# EAGLE schematic mcu (EAGLE 8.1.0)
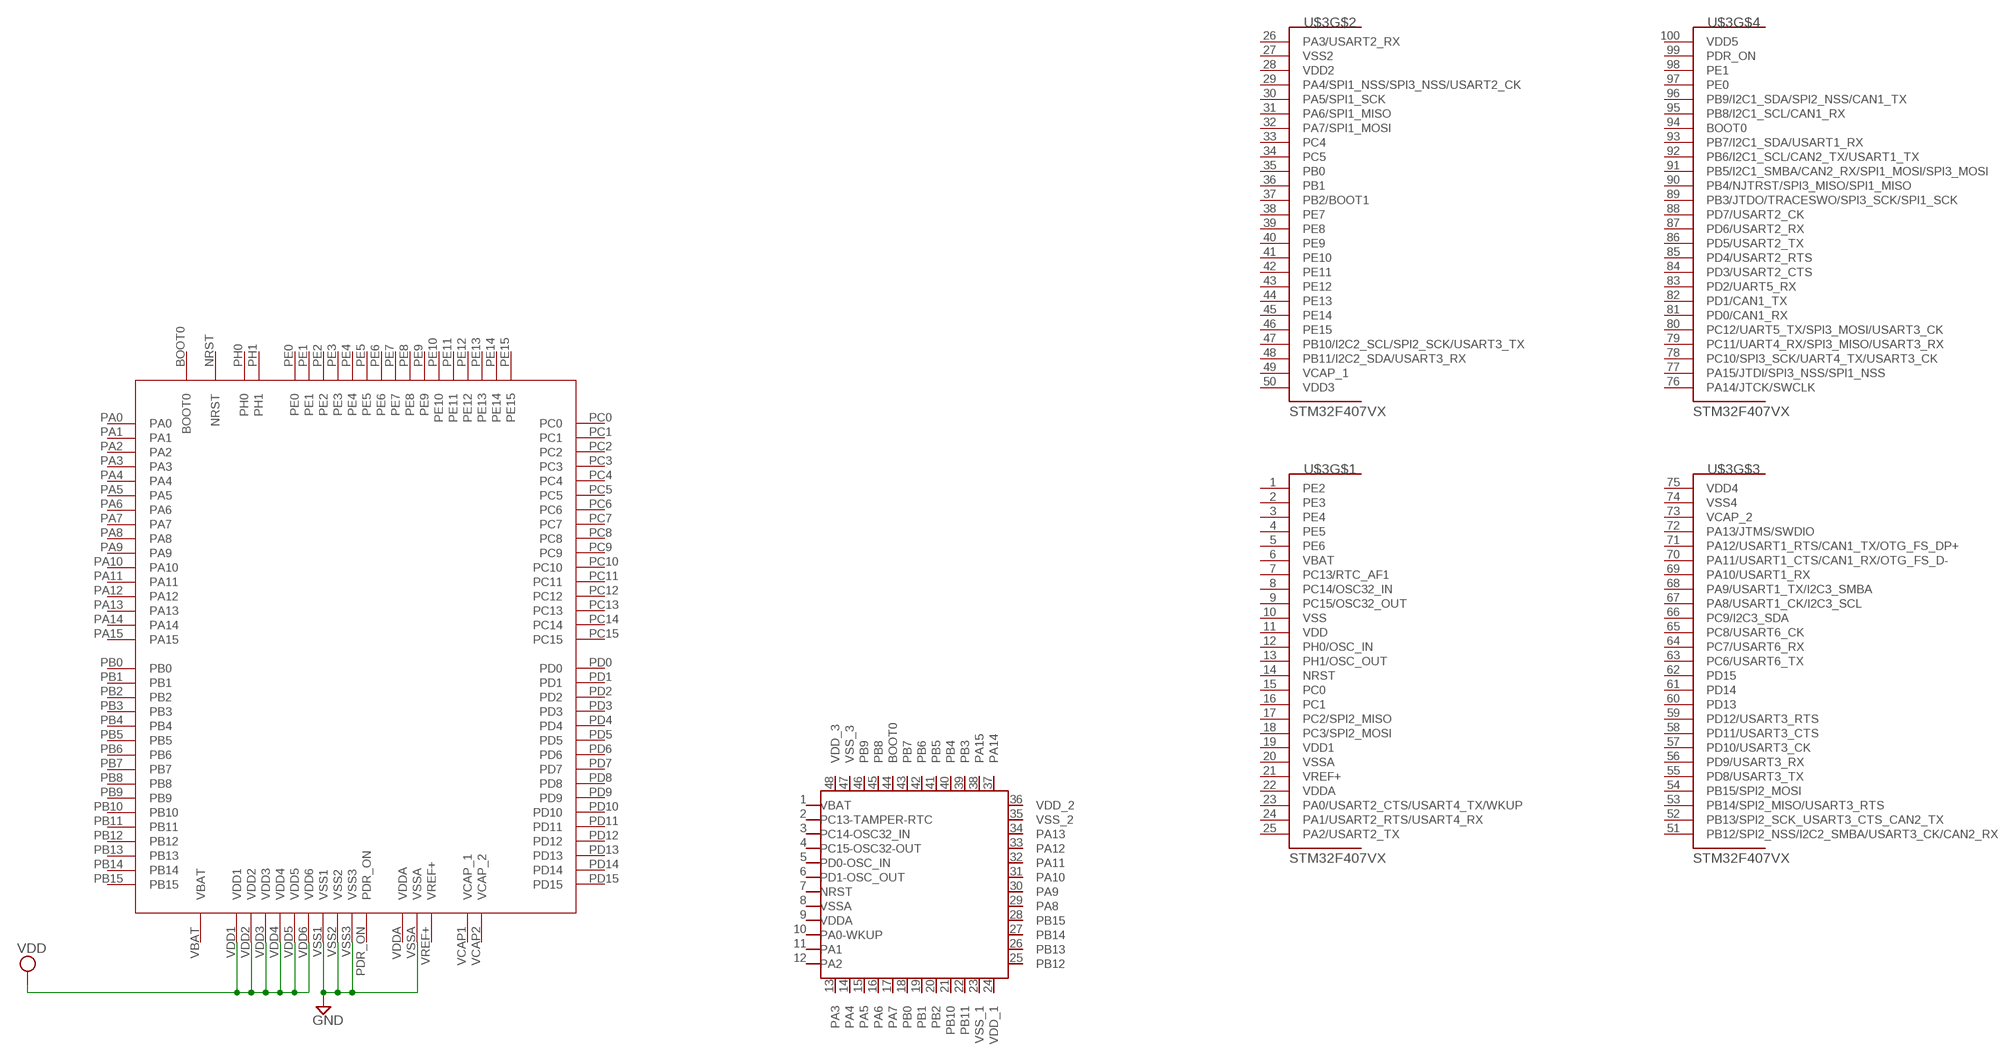
[diagram p0: schematic, sheet 1]

## Parts
U$1  STM32F4V_100PIN_GENERIC  [LQFP100]
U$2  STM32F103_TQFP48_7X7  [LQFP48_7X7]
U$3  STM32F407VX  [LQFP100]

## Nets
GND: U$1.VSS1 U$1.VSS2 U$1.VSS3 U$1.VSSA
VDD: U$1.VDD1 U$1.VDD2 U$1.VDD3 U$1.VDD4 U$1.VDD5 U$1.VDD6
Unconnected: U$1.BOOT0 U$1.NRST U$1.PA0 U$1.PA1 U$1.PA2 U$1.PA3 U$1.PA4 U$1.PA5 U$1.PA6 U$1.PA7 U$1.PA8 U$1.PA9 U$1.PA10 U$1.PA11 U$1.PA12 U$1.PA13 U$1.PA14 U$1.PA15 U$1.PB0 U$1.PB1 U$1.PB2 U$1.PB3 U$1.PB4 U$1.PB5 U$1.PB6 U$1.PB7 U$1.PB8 U$1.PB9 U$1.PB10 U$1.PB11 U$1.PB12 U$1.PB13 U$1.PB14 U$1.PB15 U$1.PC0 U$1.PC1 U$1.PC2 U$1.PC3 U$1.PC4 U$1.PC5 U$1.PC6 U$1.PC7 U$1.PC8 U$1.PC9 U$1.PC10 U$1.PC11 U$1.PC12 U$1.PC13 U$1.PC14 U$1.PC15 U$1.PD0 U$1.PD1 U$1.PD2 U$1.PD3 U$1.PD4 U$1.PD5 U$1.PD6 U$1.PD7 U$1.PD8 U$1.PD9 U$1.PD10 U$1.PD11 U$1.PD12 U$1.PD13 U$1.PD14 U$1.PD15 U$1.PDR_ON U$1.PE0 U$1.PE1 U$1.PE2 U$1.PE3 U$1.PE4 U$1.PE5 U$1.PE6 U$1.PE7 U$1.PE8 U$1.PE9 U$1.PE10 U$1.PE11 U$1.PE12 U$1.PE13 U$1.PE14 U$1.PE15 U$1.PH0 U$1.PH1 U$1.VBAT U$1.VCAP1(VCAP_1) U$1.VCAP2(VCAP_2) U$1.VDDA U$1.VREF+ U$2.1(VBAT) U$2.2(PC13-TAMPER-RTC) U$2.3(PC14-OSC32_IN) U$2.4(PC15-OSC32-OUT) U$2.5(PD0-OSC_IN) U$2.6(PD1-OSC_OUT) U$2.7(NRST) U$2.8(VSSA) U$2.9(VDDA) U$2.10(PA0-WKUP) U$2.11(PA1) U$2.12(PA2) U$2.13(PA3) U$2.14(PA4) U$2.15(PA5) U$2.16(PA6) U$2.17(PA7) U$2.18(PB0) U$2.19(PB1) U$2.20(PB2) U$2.21(PB10) U$2.22(PB11) U$2.23(VSS_1) U$2.24(VDD_1) U$2.25(PB12) U$2.26(PB13) U$2.27(PB14) U$2.28(PB15) U$2.29(PA8) U$2.30(PA9) U$2.31(PA10) U$2.32(PA11) U$2.33(PA12) U$2.34(PA13) U$2.35(VSS_2) U$2.36(VDD_2) U$2.37(PA14) U$2.38(PA15) U$2.39(PB3) U$2.40(PB4) U$2.41(PB5) U$2.42(PB6) U$2.43(PB7) U$2.44(BOOT0) U$2.45(PB8) U$2.46(PB9) U$2.47(VSS_3) U$2.48(VDD_3) U$3.1(PE2) U$3.2(PE3) U$3.3(PE4) U$3.4(PE5) U$3.5(PE6) U$3.6(VBAT) U$3.7(PC13/RTC_AF1) U$3.8(PC14/OSC32_IN) U$3.9(PC15/OSC32_OUT) U$3.10(VSS) U$3.11(VDD) U$3.12(PH0/OSC_IN) U$3.13(PH1/OSC_OUT) U$3.14(NRST) U$3.15(PC0) U$3.16(PC1) U$3.17(PC2/SPI2_MISO) U$3.18(PC3/SPI2_MOSI) U$3.19(VDD1) U$3.20(VSSA) U$3.21(VREF+) U$3.22(VDDA) U$3.23(PA0/USART2_CTS/USART4_TX/WKUP) U$3.24(PA1/USART2_RTS/USART4_RX) U$3.25(PA2/USART2_TX) U$3.26(PA3/USART2_RX) U$3.27(VSS2) U$3.28(VDD2) U$3.29(PA4/SPI1_NSS/SPI3_NSS/USART2_CK) U$3.30(PA5/SPI1_SCK) U$3.31(PA6/SPI1_MISO) U$3.32(PA7/SPI1_MOSI) U$3.33(PC4) U$3.34(PC5) U$3.35(PB0) U$3.36(PB1) U$3.37(PB2/BOOT1) U$3.38(PE7) U$3.39(PE8) U$3.40(PE9) U$3.41(PE10) U$3.42(PE11) U$3.43(PE12) U$3.44(PE13) U$3.45(PE14) U$3.46(PE15) U$3.47(PB10/I2C2_SCL/SPI2_SCK/USART3_TX) U$3.48(PB11/I2C2_SDA/USART3_RX) U$3.49(VCAP_1) U$3.50(VDD3) U$3.51(PB12/SPI2_NSS/I2C2_SMBA/USART3_CK/CAN2_RX) U$3.52(PB13/SPI2_SCK_USART3_CTS_CAN2_TX) U$3.53(PB14/SPI2_MISO/USART3_RTS) U$3.54(PB15/SPI2_MOSI) U$3.55(PD8/USART3_TX) U$3.56(PD9/USART3_RX) U$3.57(PD10/USART3_CK) U$3.58(PD11/USART3_CTS) U$3.59(PD12/USART3_RTS) U$3.60(PD13) U$3.61(PD14) U$3.62(PD15) U$3.63(PC6/USART6_TX) U$3.64(PC7/USART6_RX) U$3.65(PC8/USART6_CK) U$3.66(PC9/I2C3_SDA) U$3.67(PA8/USART1_CK/I2C3_SCL) U$3.68(PA9/USART1_TX/I2C3_SMBA) U$3.69(PA10/USART1_RX) U$3.70(PA11/USART1_CTS/CAN1_RX/OTG_FS_D-) U$3.71(PA12/USART1_RTS/CAN1_TX/OTG_FS_DP+) U$3.72(PA13/JTMS/SWDIO) U$3.73(VCAP_2) U$3.74(VSS4) U$3.75(VDD4) U$3.76(PA14/JTCK/SWCLK) U$3.77(PA15/JTDI/SPI3_NSS/SPI1_NSS) U$3.78(PC10/SPI3_SCK/UART4_TX/USART3_CK) U$3.79(PC11/UART4_RX/SPI3_MISO/USART3_RX) U$3.80(PC12/UART5_TX/SPI3_MOSI/USART3_CK) U$3.81(PD0/CAN1_RX) U$3.82(PD1/CAN1_TX) U$3.83(PD2/UART5_RX) U$3.84(PD3/USART2_CTS) U$3.85(PD4/USART2_RTS) U$3.86(PD5/USART2_TX) U$3.87(PD6/USART2_RX) U$3.88(PD7/USART2_CK) U$3.89(PB3/JTDO/TRACESWO/SPI3_SCK/SPI1_SCK) U$3.90(PB4/NJTRST/SPI3_MISO/SPI1_MISO) U$3.91(PB5/I2C1_SMBA/CAN2_RX/SPI1_MOSI/SPI3_MOSI) U$3.92(PB6/I2C1_SCL/CAN2_TX/USART1_TX) U$3.93(PB7/I2C1_SDA/USART1_RX) U$3.94(BOOT0) U$3.95(PB8/I2C1_SCL/CAN1_RX) U$3.96(PB9/I2C1_SDA/SPI2_NSS/CAN1_TX) U$3.97(PE0) U$3.98(PE1) U$3.99(PDR_ON) U$3.100(VDD5)

## Library data of the parts
U$1 = stm32f4:STM32F4V_100PIN_GENERIC
U$2 = dan:STM32F103_TQFP48_7X7
U$3 = STM32F407Vx_LQFP100:STM32F407VX: STmicroelectronics Cortex M4 Series Typ: STM32F407Vx LQFP100 Copyright 2012 by Ersan Günes, Quantitec, info@quantitec.de